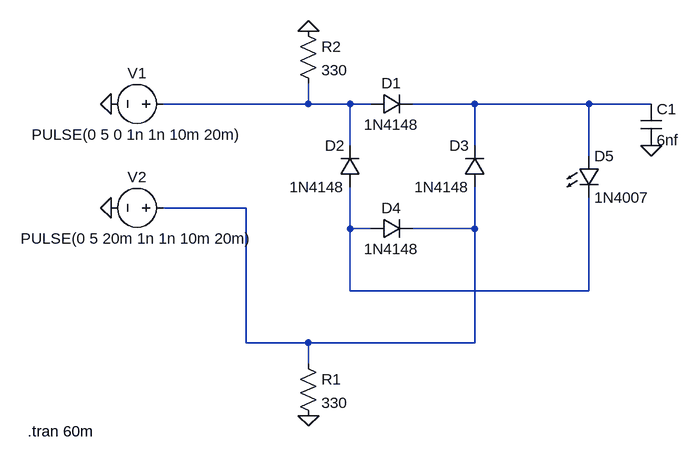
[diagram p0: schematic Xor-Gate-Using-Diodes & Resistors.asc]
Xor-Gate-Using-Diodes & Resistors.asc, the LTspice schematic file:
Version 4.1
SHEET 1 912 680
WIRE 336 80 336 48
WIRE 336 80 112 80
WIRE 400 80 336 80
WIRE 432 80 400 80
WIRE 592 80 496 80
WIRE 768 80 592 80
WIRE 864 80 768 80
WIRE 400 144 400 80
WIRE 592 144 592 80
WIRE 768 160 768 80
WIRE 240 240 112 240
WIRE 400 272 400 208
WIRE 432 272 400 272
WIRE 592 272 592 208
WIRE 592 272 496 272
WIRE 400 368 400 272
WIRE 768 368 768 224
WIRE 768 368 400 368
WIRE 240 448 240 240
WIRE 336 448 240 448
WIRE 592 448 592 272
WIRE 592 448 336 448
WIRE 336 480 336 448
FLAG 32 80 0
FLAG 32 240 0
FLAG 336 560 0
FLAG 336 -32 0
FLAG 864 144 0
SYMBOL voltage 128 80 R90
WINDOW 0 -32 56 VBottom 2
WINDOW 3 32 56 VTop 2
WINDOW 123 0 0 Left 0
WINDOW 39 0 0 Left 0
SYMATTR InstName V1
SYMATTR Value PULSE(0 5 0 1n 1n 10m 20m)
SYMBOL diode 432 96 R270
WINDOW 0 32 32 VTop 2
WINDOW 3 0 32 VBottom 2
SYMATTR InstName D1
SYMATTR Value 1N4148
SYMBOL diode 416 208 R180
WINDOW 0 24 64 Left 2
WINDOW 3 24 0 Left 2
SYMATTR InstName D2
SYMATTR Value 1N4148
SYMBOL diode 608 208 R180
WINDOW 0 24 64 Left 2
WINDOW 3 24 0 Left 2
SYMATTR InstName D3
SYMATTR Value 1N4148
SYMBOL diode 432 288 R270
WINDOW 0 32 32 VTop 2
WINDOW 3 0 32 VBottom 2
SYMATTR InstName D4
SYMATTR Value 1N4148
SYMBOL LED 752 160 R0
SYMATTR InstName D5
SYMATTR Value 1N4007
SYMBOL res 320 464 R0
SYMATTR InstName R1
SYMATTR Value 330
SYMBOL res 320 -48 R0
SYMATTR InstName R2
SYMATTR Value 330
SYMBOL voltage 128 240 R90
WINDOW 0 -32 56 VBottom 2
WINDOW 3 32 56 VTop 2
WINDOW 123 0 0 Left 0
WINDOW 39 0 0 Left 0
SYMATTR InstName V2
SYMATTR Value PULSE(0 5 20m 1n 1n 10m 20m)
SYMBOL cap 848 80 R0
SYMATTR InstName C1
SYMATTR Value 6nf
TEXT -96 584 Left 2 !.tran 60m

The netlist it stands for:
* Xor-Gate-Using-Diodes & Resistors.asc
V1 N001 0 PULSE(0 5 0 1n 1n 10m 20m)
D1 N001 N002 1N4148
D2 N004 N001 1N4148
D3 N003 N002 1N4148
D4 N004 N003 1N4148
D5 N002 N004 1N4007
R1 N003 0 330
R2 0 N001 330
V2 N003 0 PULSE(0 5 20m 1n 1n 10m 20m)
C1 N002 0 6nf
.model D D
.lib standard.dio
.tran 60m
.backanno
.end